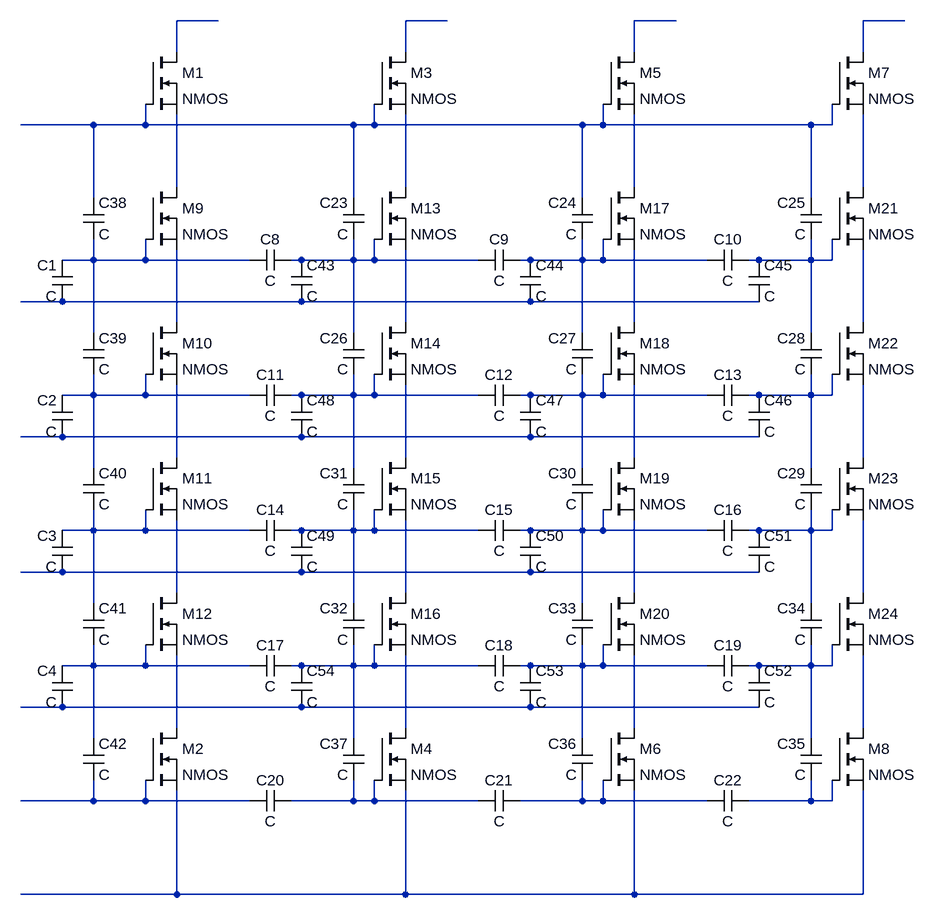
[diagram p0: schematic nand_flash.asc]
nand_flash.asc, the LTspice schematic file:
Version 4
SHEET 1 1624 1524
WIRE 496 80 432 80
WIRE 848 80 784 80
WIRE 1200 80 1136 80
WIRE 1552 80 1488 80
WIRE 432 128 432 80
WIRE 784 128 784 80
WIRE 1136 128 1136 80
WIRE 1488 128 1488 80
WIRE 304 240 192 240
WIRE 384 240 384 208
WIRE 384 240 304 240
WIRE 704 240 384 240
WIRE 736 240 736 208
WIRE 736 240 704 240
WIRE 1056 240 736 240
WIRE 1088 240 1088 208
WIRE 1088 240 1056 240
WIRE 1408 240 1088 240
WIRE 1440 240 1440 208
WIRE 1440 240 1408 240
WIRE 432 336 432 224
WIRE 784 336 784 224
WIRE 1136 336 1136 224
WIRE 1488 336 1488 224
WIRE 304 352 304 240
WIRE 704 352 704 240
WIRE 1056 352 1056 240
WIRE 1408 352 1408 240
WIRE 304 448 304 416
WIRE 304 448 256 448
WIRE 384 448 384 416
WIRE 384 448 304 448
WIRE 544 448 384 448
WIRE 624 448 608 448
WIRE 704 448 704 416
WIRE 704 448 624 448
WIRE 736 448 736 416
WIRE 736 448 704 448
WIRE 896 448 736 448
WIRE 976 448 960 448
WIRE 1056 448 1056 416
WIRE 1056 448 976 448
WIRE 1088 448 1088 416
WIRE 1088 448 1056 448
WIRE 1248 448 1088 448
WIRE 1328 448 1312 448
WIRE 1408 448 1408 416
WIRE 1408 448 1328 448
WIRE 1440 448 1440 416
WIRE 1440 448 1408 448
WIRE 256 512 192 512
WIRE 624 512 256 512
WIRE 976 512 624 512
WIRE 1328 512 976 512
WIRE 432 544 432 432
WIRE 784 544 784 432
WIRE 1136 544 1136 432
WIRE 1488 544 1488 432
WIRE 304 560 304 448
WIRE 704 560 704 448
WIRE 1056 560 1056 448
WIRE 1408 560 1408 448
WIRE 304 656 304 624
WIRE 304 656 256 656
WIRE 384 656 384 624
WIRE 384 656 304 656
WIRE 544 656 384 656
WIRE 624 656 608 656
WIRE 704 656 704 624
WIRE 704 656 624 656
WIRE 736 656 736 624
WIRE 736 656 704 656
WIRE 896 656 736 656
WIRE 976 656 960 656
WIRE 1056 656 1056 624
WIRE 1056 656 976 656
WIRE 1088 656 1088 624
WIRE 1088 656 1056 656
WIRE 1248 656 1088 656
WIRE 1328 656 1312 656
WIRE 1408 656 1408 624
WIRE 1408 656 1328 656
WIRE 1440 656 1440 624
WIRE 1440 656 1408 656
WIRE 256 720 192 720
WIRE 624 720 256 720
WIRE 976 720 624 720
WIRE 1328 720 976 720
WIRE 432 752 432 640
WIRE 784 752 784 640
WIRE 1136 752 1136 640
WIRE 1488 752 1488 640
WIRE 304 768 304 656
WIRE 704 768 704 656
WIRE 1056 768 1056 656
WIRE 1408 768 1408 656
WIRE 304 864 304 832
WIRE 304 864 256 864
WIRE 384 864 384 832
WIRE 384 864 304 864
WIRE 544 864 384 864
WIRE 624 864 608 864
WIRE 704 864 704 832
WIRE 704 864 624 864
WIRE 736 864 736 832
WIRE 736 864 704 864
WIRE 896 864 736 864
WIRE 976 864 960 864
WIRE 1056 864 1056 832
WIRE 1056 864 976 864
WIRE 1088 864 1088 832
WIRE 1088 864 1056 864
WIRE 1248 864 1088 864
WIRE 1328 864 1312 864
WIRE 1408 864 1408 832
WIRE 1408 864 1328 864
WIRE 1440 864 1440 832
WIRE 1440 864 1408 864
WIRE 256 928 192 928
WIRE 624 928 256 928
WIRE 976 928 624 928
WIRE 1328 928 976 928
WIRE 432 960 432 848
WIRE 784 960 784 848
WIRE 1136 960 1136 848
WIRE 1488 960 1488 848
WIRE 304 976 304 864
WIRE 704 976 704 864
WIRE 1056 976 1056 864
WIRE 1408 976 1408 864
WIRE 304 1072 304 1040
WIRE 304 1072 256 1072
WIRE 384 1072 384 1040
WIRE 384 1072 304 1072
WIRE 544 1072 384 1072
WIRE 624 1072 608 1072
WIRE 704 1072 704 1040
WIRE 704 1072 624 1072
WIRE 736 1072 736 1040
WIRE 736 1072 704 1072
WIRE 896 1072 736 1072
WIRE 976 1072 960 1072
WIRE 1056 1072 1056 1040
WIRE 1056 1072 976 1072
WIRE 1088 1072 1088 1040
WIRE 1088 1072 1056 1072
WIRE 1248 1072 1088 1072
WIRE 1328 1072 1312 1072
WIRE 1408 1072 1408 1040
WIRE 1408 1072 1328 1072
WIRE 1440 1072 1440 1040
WIRE 1440 1072 1408 1072
WIRE 256 1136 192 1136
WIRE 624 1136 256 1136
WIRE 976 1136 624 1136
WIRE 1328 1136 976 1136
WIRE 432 1168 432 1056
WIRE 784 1168 784 1056
WIRE 1136 1168 1136 1056
WIRE 1488 1168 1488 1056
WIRE 304 1184 304 1072
WIRE 704 1184 704 1072
WIRE 1056 1184 1056 1072
WIRE 1408 1184 1408 1072
WIRE 304 1280 304 1248
WIRE 304 1280 192 1280
WIRE 384 1280 384 1248
WIRE 384 1280 304 1280
WIRE 544 1280 384 1280
WIRE 704 1280 704 1248
WIRE 704 1280 608 1280
WIRE 736 1280 736 1248
WIRE 736 1280 704 1280
WIRE 896 1280 736 1280
WIRE 1056 1280 1056 1248
WIRE 1056 1280 960 1280
WIRE 1088 1280 1088 1248
WIRE 1088 1280 1056 1280
WIRE 1248 1280 1088 1280
WIRE 1408 1280 1408 1248
WIRE 1408 1280 1312 1280
WIRE 1440 1280 1440 1248
WIRE 1440 1280 1408 1280
WIRE 432 1424 432 1264
WIRE 432 1424 192 1424
WIRE 784 1424 784 1264
WIRE 784 1424 432 1424
WIRE 1136 1424 1136 1264
WIRE 1136 1424 784 1424
WIRE 1488 1424 1488 1264
WIRE 1488 1424 1136 1424
SYMBOL nmos 384 128 R0
SYMATTR InstName M1
SYMBOL nmos 384 1168 R0
SYMATTR InstName M2
SYMBOL nmos 736 128 R0
SYMATTR InstName M3
SYMBOL nmos 736 1168 R0
SYMATTR InstName M4
SYMBOL nmos 1088 128 R0
SYMATTR InstName M5
SYMBOL nmos 1088 1168 R0
SYMATTR InstName M6
SYMBOL nmos 1440 128 R0
SYMATTR InstName M7
SYMBOL nmos 1440 1168 R0
SYMATTR InstName M8
SYMBOL nmos 384 336 R0
SYMATTR InstName M9
SYMBOL nmos 384 544 R0
SYMATTR InstName M10
SYMBOL nmos 384 752 R0
SYMATTR InstName M11
SYMBOL nmos 384 960 R0
SYMATTR InstName M12
SYMBOL nmos 736 336 R0
SYMATTR InstName M13
SYMBOL nmos 736 544 R0
SYMATTR InstName M14
SYMBOL nmos 736 752 R0
SYMATTR InstName M15
SYMBOL nmos 736 960 R0
SYMATTR InstName M16
SYMBOL nmos 1088 336 R0
SYMATTR InstName M17
SYMBOL nmos 1088 544 R0
SYMATTR InstName M18
SYMBOL nmos 1088 752 R0
SYMATTR InstName M19
SYMBOL nmos 1088 960 R0
SYMATTR InstName M20
SYMBOL nmos 1440 336 R0
SYMATTR InstName M21
SYMBOL nmos 1440 544 R0
SYMATTR InstName M22
SYMBOL nmos 1440 752 R0
SYMATTR InstName M23
SYMBOL nmos 1440 960 R0
SYMATTR InstName M24
SYMBOL cap 272 512 R180
WINDOW 0 24 56 Left 2
WINDOW 3 24 8 Left 2
SYMATTR InstName C1
SYMBOL cap 272 720 R180
WINDOW 0 24 56 Left 2
WINDOW 3 24 8 Left 2
SYMATTR InstName C2
SYMBOL cap 272 928 R180
WINDOW 0 24 56 Left 2
WINDOW 3 24 8 Left 2
SYMATTR InstName C3
SYMBOL cap 272 1136 R180
WINDOW 0 24 56 Left 2
WINDOW 3 24 8 Left 2
SYMATTR InstName C4
SYMBOL cap 544 432 M90
WINDOW 0 0 32 VBottom 2
WINDOW 3 32 32 VTop 2
SYMATTR InstName C8
SYMBOL cap 896 432 M90
WINDOW 0 0 32 VBottom 2
WINDOW 3 32 32 VTop 2
SYMATTR InstName C9
SYMBOL cap 1248 432 M90
WINDOW 0 0 32 VBottom 2
WINDOW 3 32 32 VTop 2
SYMATTR InstName C10
SYMBOL cap 544 640 M90
WINDOW 0 0 32 VBottom 2
WINDOW 3 32 32 VTop 2
SYMATTR InstName C11
SYMBOL cap 896 640 M90
WINDOW 0 0 32 VBottom 2
WINDOW 3 32 32 VTop 2
SYMATTR InstName C12
SYMBOL cap 1248 640 M90
WINDOW 0 0 32 VBottom 2
WINDOW 3 32 32 VTop 2
SYMATTR InstName C13
SYMBOL cap 544 848 M90
WINDOW 0 0 32 VBottom 2
WINDOW 3 32 32 VTop 2
SYMATTR InstName C14
SYMBOL cap 896 848 M90
WINDOW 0 0 32 VBottom 2
WINDOW 3 32 32 VTop 2
SYMATTR InstName C15
SYMBOL cap 1248 848 M90
WINDOW 0 0 32 VBottom 2
WINDOW 3 32 32 VTop 2
SYMATTR InstName C16
SYMBOL cap 544 1056 M90
WINDOW 0 0 32 VBottom 2
WINDOW 3 32 32 VTop 2
SYMATTR InstName C17
SYMBOL cap 896 1056 M90
WINDOW 0 0 32 VBottom 2
WINDOW 3 32 32 VTop 2
SYMATTR InstName C18
SYMBOL cap 1248 1056 M90
WINDOW 0 0 32 VBottom 2
WINDOW 3 32 32 VTop 2
SYMATTR InstName C19
SYMBOL cap 544 1264 M90
WINDOW 0 0 32 VBottom 2
WINDOW 3 32 32 VTop 2
SYMATTR InstName C20
SYMBOL cap 896 1264 M90
WINDOW 0 0 32 VBottom 2
WINDOW 3 32 32 VTop 2
SYMATTR InstName C21
SYMBOL cap 1248 1264 M90
WINDOW 0 0 32 VBottom 2
WINDOW 3 32 32 VTop 2
SYMATTR InstName C22
SYMBOL cap 720 352 M0
SYMATTR InstName C23
SYMBOL cap 1072 352 M0
SYMATTR InstName C24
SYMBOL cap 1424 352 M0
SYMATTR InstName C25
SYMBOL cap 720 560 M0
SYMATTR InstName C26
SYMBOL cap 1072 560 M0
SYMATTR InstName C27
SYMBOL cap 1424 560 M0
SYMATTR InstName C28
SYMBOL cap 1424 768 M0
SYMATTR InstName C29
SYMBOL cap 1072 768 M0
SYMATTR InstName C30
SYMBOL cap 720 768 M0
SYMATTR InstName C31
SYMBOL cap 720 976 M0
SYMATTR InstName C32
SYMBOL cap 1072 976 M0
SYMATTR InstName C33
SYMBOL cap 1424 976 M0
SYMATTR InstName C34
SYMBOL cap 1424 1184 M0
SYMATTR InstName C35
SYMBOL cap 1072 1184 M0
SYMATTR InstName C36
SYMBOL cap 720 1184 M0
SYMATTR InstName C37
SYMBOL cap 288 352 R0
SYMATTR InstName C38
SYMBOL cap 288 560 R0
SYMATTR InstName C39
SYMBOL cap 288 768 R0
SYMATTR InstName C40
SYMBOL cap 288 976 R0
SYMATTR InstName C41
SYMBOL cap 288 1184 R0
SYMATTR InstName C42
SYMBOL cap 608 448 R0
SYMATTR InstName C43
SYMBOL cap 960 448 R0
SYMATTR InstName C44
SYMBOL cap 1312 448 R0
SYMATTR InstName C45
SYMBOL cap 1312 656 R0
SYMATTR InstName C46
SYMBOL cap 960 656 R0
SYMATTR InstName C47
SYMBOL cap 608 656 R0
SYMATTR InstName C48
SYMBOL cap 608 864 R0
SYMATTR InstName C49
SYMBOL cap 960 864 R0
SYMATTR InstName C50
SYMBOL cap 1312 864 R0
SYMATTR InstName C51
SYMBOL cap 1312 1072 R0
SYMATTR InstName C52
SYMBOL cap 960 1072 R0
SYMATTR InstName C53
SYMBOL cap 608 1072 R0
SYMATTR InstName C54

The netlist it stands for:
* nand_flash.asc
M1 N001 N005 N006 N006 NMOS
M2 N042 N046 N050 N050 NMOS
M3 N002 N005 N007 N007 NMOS
M4 N043 N047 N050 N050 NMOS
M5 N003 N005 N008 N008 NMOS
M6 N044 N048 N050 N050 NMOS
M7 N004 N005 N009 N009 NMOS
M8 N045 N049 N050 N050 NMOS
M9 N006 N010 N015 N015 NMOS
M10 N015 N019 N024 N024 NMOS
M11 N024 N028 N033 N033 NMOS
M12 N033 N037 N042 N042 NMOS
M13 N007 N011 N016 N016 NMOS
M14 N016 N020 N025 N025 NMOS
M15 N025 N029 N034 N034 NMOS
M16 N034 N038 N043 N043 NMOS
M17 N008 N012 N017 N017 NMOS
M18 N017 N021 N026 N026 NMOS
M19 N026 N030 N035 N035 NMOS
M20 N035 N039 N044 N044 NMOS
M21 N009 N013 N018 N018 NMOS
M22 N018 N022 N027 N027 NMOS
M23 N027 N031 N036 N036 NMOS
M24 N036 N040 N045 N045 NMOS
C1 N014 N010 C
C2 N023 N019 C
C3 N032 N028 C
C4 N041 N037 C
C8 N010 N011 C
C9 N011 N012 C
C10 N012 N013 C
C11 N019 N020 C
C12 N020 N021 C
C13 N021 N022 C
C14 N028 N029 C
C15 N029 N030 C
C16 N030 N031 C
C17 N037 N038 C
C18 N038 N039 C
C19 N039 N040 C
C20 N046 N047 C
C21 N047 N048 C
C22 N048 N049 C
C23 N005 N011 C
C24 N005 N012 C
C25 N005 N013 C
C26 N011 N020 C
C27 N012 N021 C
C28 N013 N022 C
C29 N022 N031 C
C30 N021 N030 C
C31 N020 N029 C
C32 N029 N038 C
C33 N030 N039 C
C34 N031 N040 C
C35 N040 N049 C
C36 N039 N048 C
C37 N038 N047 C
C38 N005 N010 C
C39 N010 N019 C
C40 N019 N028 C
C41 N028 N037 C
C42 N037 N046 C
C43 N011 N014 C
C44 N012 N014 C
C45 N013 N014 C
C46 N022 N023 C
C47 N021 N023 C
C48 N020 N023 C
C49 N029 N032 C
C50 N030 N032 C
C51 N031 N032 C
C52 N040 N041 C
C53 N039 N041 C
C54 N038 N041 C
.model NMOS NMOS
.model PMOS PMOS
.lib standard.mos
.backanno
.end